# EAGLE design reflow (EAGLE 5.11)
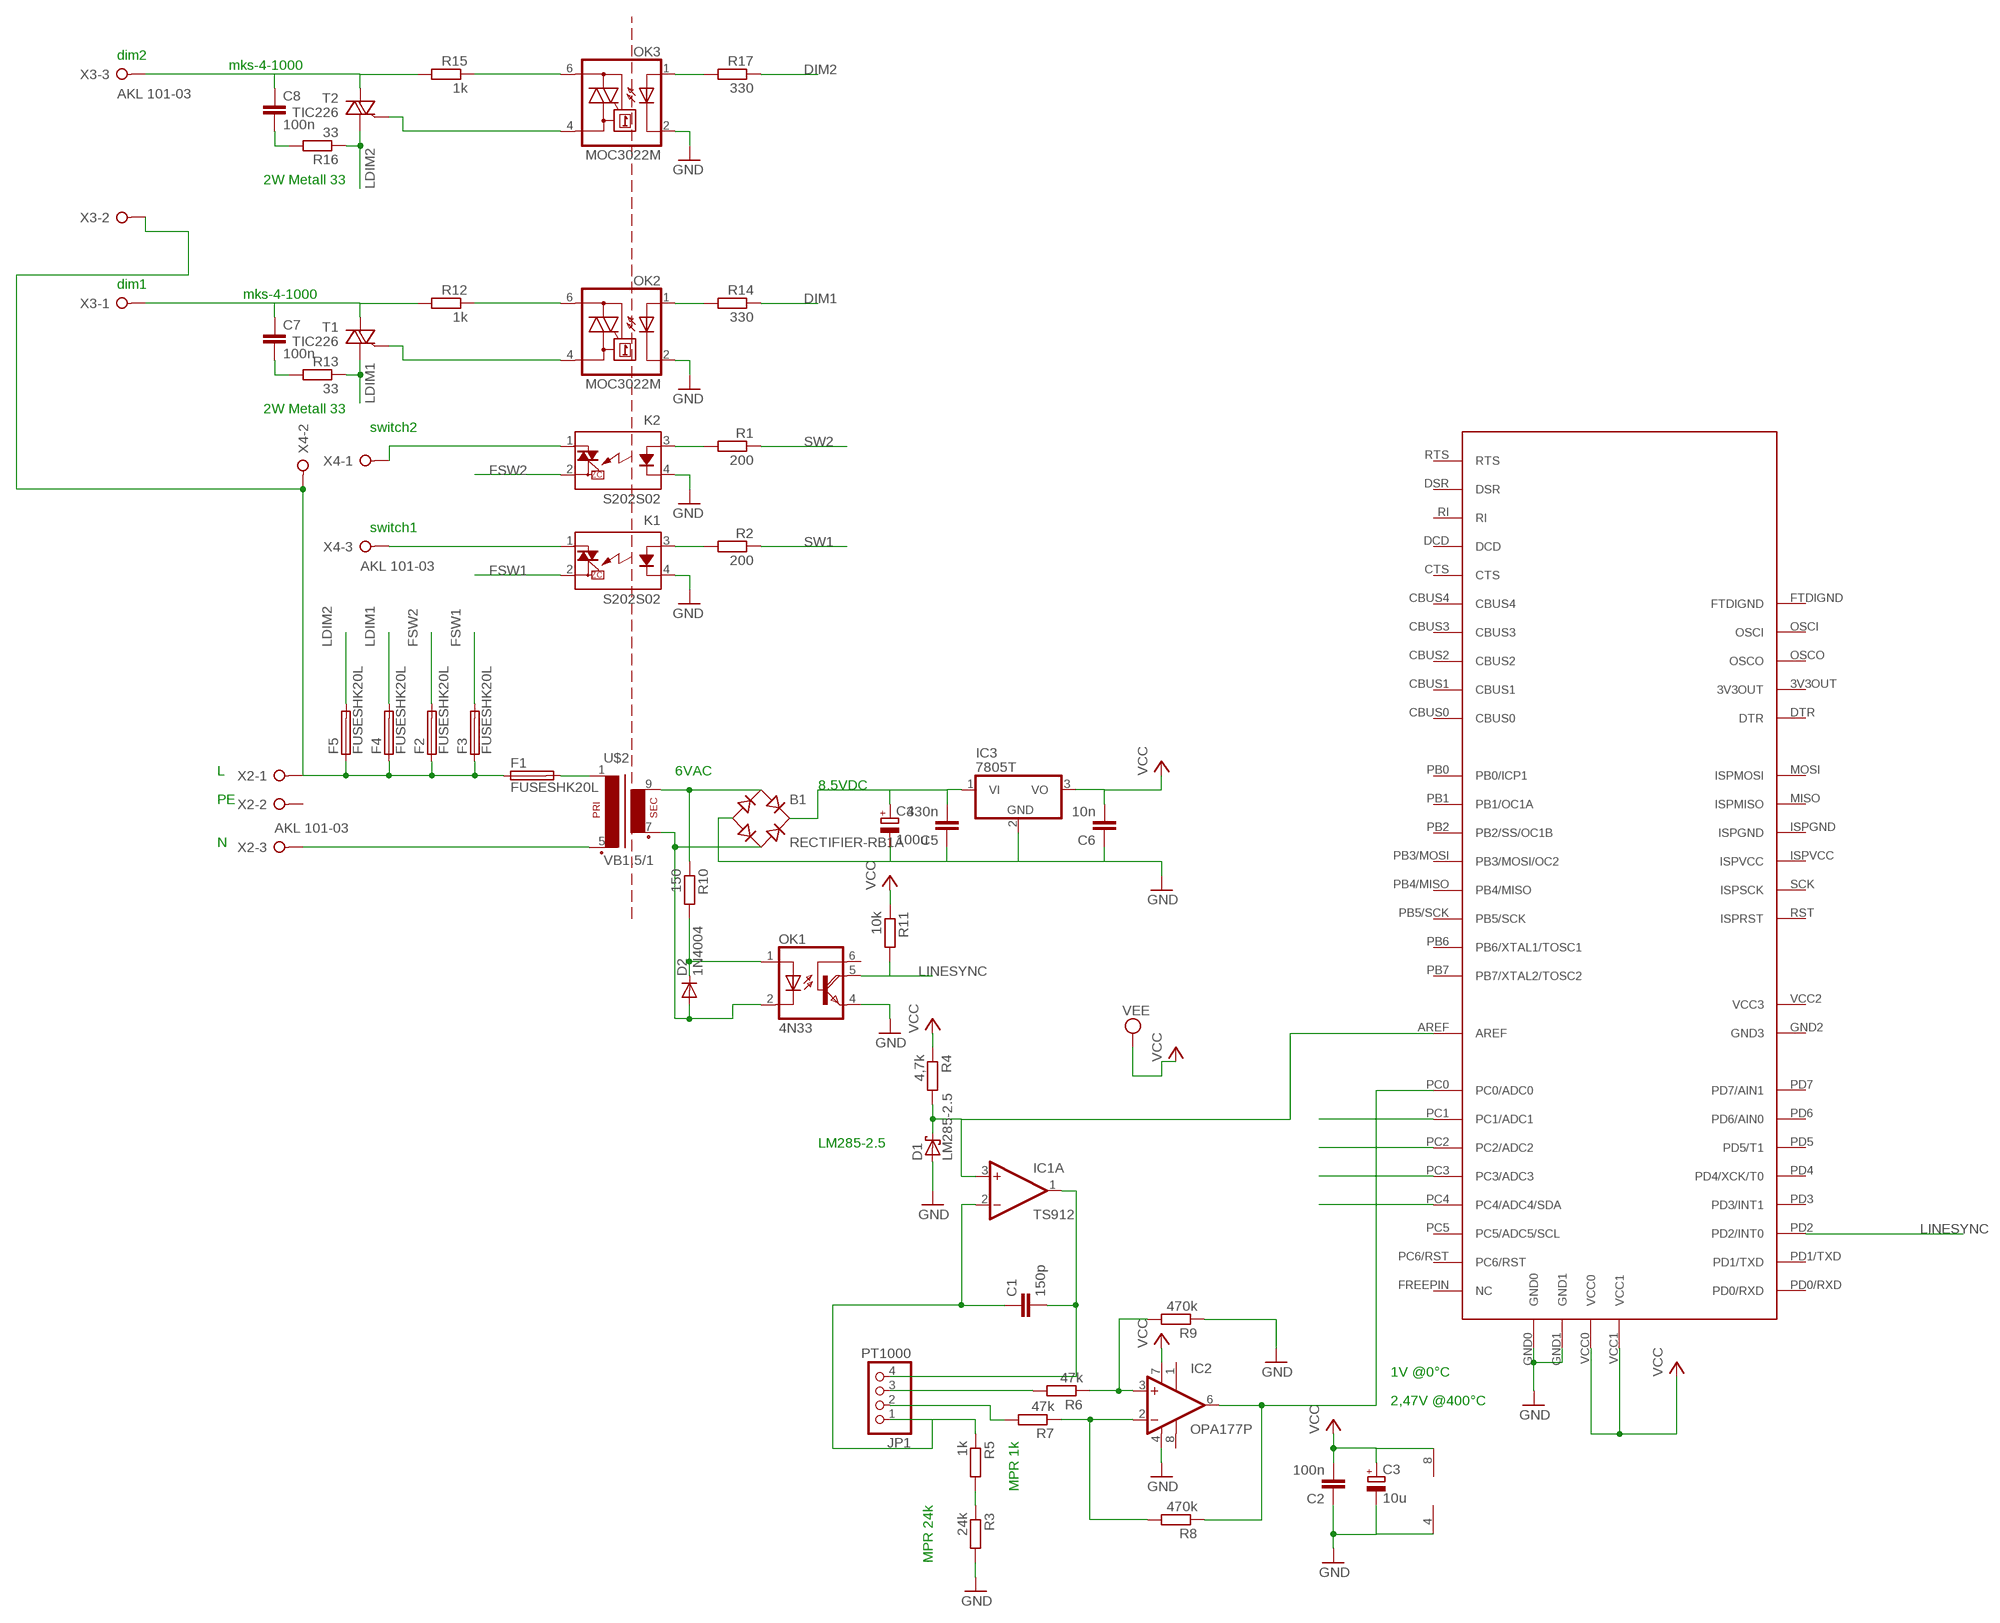
[diagram p0: schematic, sheet 1]

## Parts
B1  RECTIFIER-RB1A  [RB1A]
C1  150p  C-EU050-025X075  [C050-025X075]
C2  100n  C-EU050-025X075  [C050-025X075]
C3  10u  CPOL-EUE2-4  [E2-4]
C4  100u  CPOL-EUE5-13  [E5-13]
C5  330n  C-EU050-025X075  [C050-025X075]
C6  10n  C-EU050-025X075  [C050-025X075]
C7  100n  C-EU225-108X268  [C225-108X268]
C8  100n  C-EU225-108X268  [C225-108X268]
D1  LM285-2.5  SCHOTTKY-DIODETO92H  [TO92H]
D2  1N4004  [DO41-10]
F1  FUSESHK20L  [SHK20L]
F2  FUSESHK20L  [SHK20L]
F3  FUSESHK20L  [SHK20L]
F4  FUSESHK20L  [SHK20L]
F5  FUSESHK20L  [SHK20L]
IC1  TS912  LM358N  [DIL08]
IC2  OPA177P  [DIL08]
IC3  7805T  [TO220H]
JP1  PT1000  PINHD-1X4  [1X04]
K1  S202S02  [S202S02]
K2  S202S02  [S202S02]
OK1  4N33  [DIL06]
OK2  MOC3022M  [DIL06]
OK3  MOC3022M  [DIL06]
R1  200  R-EU_0207/10  [0207/10]
R2  200  R-EU_0207/10  [0207/10]
R3  24k  R-EU_0207/10  [0207/10]
R4  4,7k  R-EU_0207/10  [0207/10]
R5  1k  R-EU_0207/10  [0207/10]
R6  47k  R-EU_0207/10  [0207/10]
R7  47k  R-EU_0207/10  [0207/10]
R8  470k  R-EU_0207/10  [0207/10]
R9  470k  R-EU_0207/10  [0207/10]
R10  150  R-EU_0207/10  [0207/10]
R11  10k  R-EU_0207/10  [0207/10]
R12  1k  R-EU_0207/10  [0207/10]
R13  33  R-EU_0309/12  [0309/12]
R14  330  R-EU_0207/10  [0207/10]
R15  1k  R-EU_0207/10  [0207/10]
R16  33  R-EU_0309/12  [0309/12]
R17  330  R-EU_0207/10  [0207/10]
T1  TIC226  TIC206D  [TO220BV]
T2  TIC226  TIC206D  [TO220BV]
U$1  TORTILLA-ALL  [TORTILLA-ALL]
U$2  VB1.5/1  [VB15]
X2  AKL 101-03  W237-3E  [W237-3E]
X3  AKL 101-03  W237-3E  [W237-3E]
X4  AKL 101-03  W237-3E  [W237-3E]

## Nets
DIM1: R14.1 U$1.PC2(PC2/ADC2)
DIM2: R17.1 U$1.PC1(PC1/ADC1)
FSW1: F3.2A K1.2(DS2)
FSW2: F2.2A K2.2(DS2)
GND: B1.- C2.1 C3.- C4.- C5.1 C6.1 D1.1(A) IC1.4(P:V-) IC2.4(V-) IC3.2(GND) K1.4(K) K2.4(K) OK1.4(E) OK2.2(C) OK3.2(C) R3.2 R9.1 U$1.GND0 U$1.GND1
LDIM1: F4.2A R13.1 T1.T1(A1)
LDIM2: F5.2A R16.1 T2.T1(A1)
LINESYNC: OK1.5(COL) R11.2 U$1.PD2(PD2/INT0)
N$2: C1.1 IC1.2(A:-IN) JP1.1 R5.1
N$3: C1.2 IC1.1(A:OUT) JP1.4
N$4: R3.1 R5.2
N$5: U$2.5(P2) X2.3
N$6: IC2.3(+IN) R6.1 R9.2
N$7: IC2.2(-IN) R7.1 R8.2
N$8: JP1.3 R6.2
N$9: JP1.2 R7.2
N$10: IC2.6(OUT) R8.1 U$1.PC0(PC0/ADC0)
N$11: C8.2 R16.2
N$12: C7.2 R13.2
N$13: K2.1(DS1) X4.1
N$14: K1.3(A) R2.2
N$15: K2.3(A) R1.2
N$16: K1.1(DS1) X4.3
N$17: D2.C OK1.1(A) R10.2
N$18: F1.2A U$2.1
N$19: B1.AC1 R10.1 U$2.9(S4)
N$20: OK2.6(A2) R12.1
N$21: OK2.4(A1) T1.G
N$22: B1.+ C4.+ C5.2 IC3.1(VI)
N$23: F1.1A F2.1A F3.1A F4.1A F5.1A X2.1 X3.2 X4.2
N$24: B1.AC2 D2.A OK1.2(C) U$2.7(S3)
N$25: D1.2(C) IC1.3(A:+IN) R4.2 U$1.AREF
N$26: C7.1 R12.2 T1.T2(A2) X3.1
N$27: OK2.1(A) R14.2
N$29: OK3.6(A2) R15.1
N$30: OK3.4(A1) T2.G
N$31: C8.1 R15.2 T2.T2(A2) X3.3
N$33: OK3.1(A) R17.2
SW1: R2.1 U$1.PC4(PC4/ADC4/SDA)
SW2: R1.1 U$1.PC3(PC3/ADC3)
VCC: C2.2 C3.+ C6.2 IC1.8(P:V+) IC2.7(V+) IC3.3(VO) R4.1 R11.1 U$1.VCC0 U$1.VCC1 ; supply symbol labelled VEE
Unconnected: IC1.5(B:+IN) IC1.6(B:-IN) IC1.7(B:OUT) IC2.1(TRIM1) IC2.8(TRIM2) OK1.6(B) U$1.3V3OUT U$1.CBUS0 U$1.CBUS1 U$1.CBUS2 U$1.CBUS3 U$1.CBUS4 U$1.CTS U$1.DCD U$1.DSR U$1.DTR U$1.FREEPIN(NC) U$1.FTDIGND U$1.GND2(GND3) U$1.ISPGND U$1.ISPVCC U$1.MISO(ISPMISO) U$1.MOSI(ISPMOSI) U$1.OSCI U$1.OSCO U$1.PB0(PB0/ICP1) U$1.PB1(PB1/OC1A) U$1.PB2(PB2/SS/OC1B) U$1.PB3/MOSI(PB3/MOSI/OC2) U$1.PB4/MISO U$1.PB5/SCK U$1.PB6(PB6/XTAL1/TOSC1) U$1.PB7(PB7/XTAL2/TOSC2) U$1.PC5(PC5/ADC5/SCL) U$1.PC6/RST U$1.PD0/RXD U$1.PD1/TXD U$1.PD3(PD3/INT1) U$1.PD4(PD4/XCK/T0) U$1.PD5(PD5/T1) U$1.PD6(PD6/AIN0) U$1.PD7(PD7/AIN1) U$1.RI U$1.RST(ISPRST) U$1.RTS U$1.SCK(ISPSCK) U$1.VCC2(VCC3) X2.2

## Notes on the sheet
- dim2 | mks-4-1000
- 2W Metall 33
- dim1 | mks-4-1000
- 2W Metall 33
- switch2
- switch1
- L | 6VAC
- 8.5VDC
- PE
- N
- LM285-2.5
- 1V @0°C
- 2,47V @400°C
- MPR 1k
- MPR 24k

## Library data of the parts
B1 = rectifier:RECTIFIER-: Rectifier
C1 C2 C5-C8 = rcl:C-EU: CAPACITOR, European symbol
C3 C4 = rcl:CPOL-EU: POLARIZED CAPACITOR, European symbol
D1 = diode:SCHOTTKY-DIODE: Schottky Diode
D2 = diode:1N4004: DIODE general purpose rectifier, 1 A
F1-F5 = fuse:FUSE: Fuse; OC_FARNELL: unknown; OC_NEWARK: unknown
IC1 = linear:LM358: OP AMP also LM158; LM258; LM2904 Source: http://cache.national.com/ds/LM/LM158.pdf
IC2 = burr-brown:OPA177: Precision Operational Amplifier; MPN: OPA177GPG4; OC_FARNELL: 1219410; OC_NEWARK: 05M0933
IC3 = linear:78*: Positive VOLTAGE REGULATOR Source: http://cache.national.com/ds/LM/LM78L05.pdf http://www.fairchildsemi.com/ds/LM/LM7805.pdf
JP1 = pinhead:PINHD-1X4: PIN HEADER
K1 K2 = relay:S*02S02: IT(rms) 8A, Zero Cross type SIP 4pin Triac output SSR Source: http://sharp-world.com/products/device/lineup/data/pdf/datasheet/s102s02_e.pdf; MPN: S202S02F; OC_FARNELL: 1618475; OC_NEWARK: 14N9588
OK1 = optocoupler:4N33: MOTOROLA OPTO COUPLER; MF: VISHAY/TELEFUNKEN; MPN: 4N33; OC_FARNELL: 1469601; OC_NEWARK: 88K1390
OK2 OK3 = optocoupler:MOC30*M: RANDOM-PHASE OPTOISOLATORS TRIAC DRIVER OUTPUT Source: http://www.fairchildsemi.com MOC3020-M.pdf; MF: FAIRCHILD SEMICONDUCTOR; MPN: MOC3022-M; OC_FARNELL: 1021086; OC_NEWARK: 58K1956
R1-R17 = rcl:R-EU_: RESISTOR, European symbol
T1 T2 = triac:TIC206: TRIAC Source: http://www.bourns.com/pdfs/tic206.pdf
U$1 = custom:TORTILLA-ALL
U$2 = custom:VB1.5/1
X2-X4 = con-wago-508:W237-3E: WAGO SREW CLAMP; OC_FARNELL: unknown; OC_NEWARK: unknown

## Board
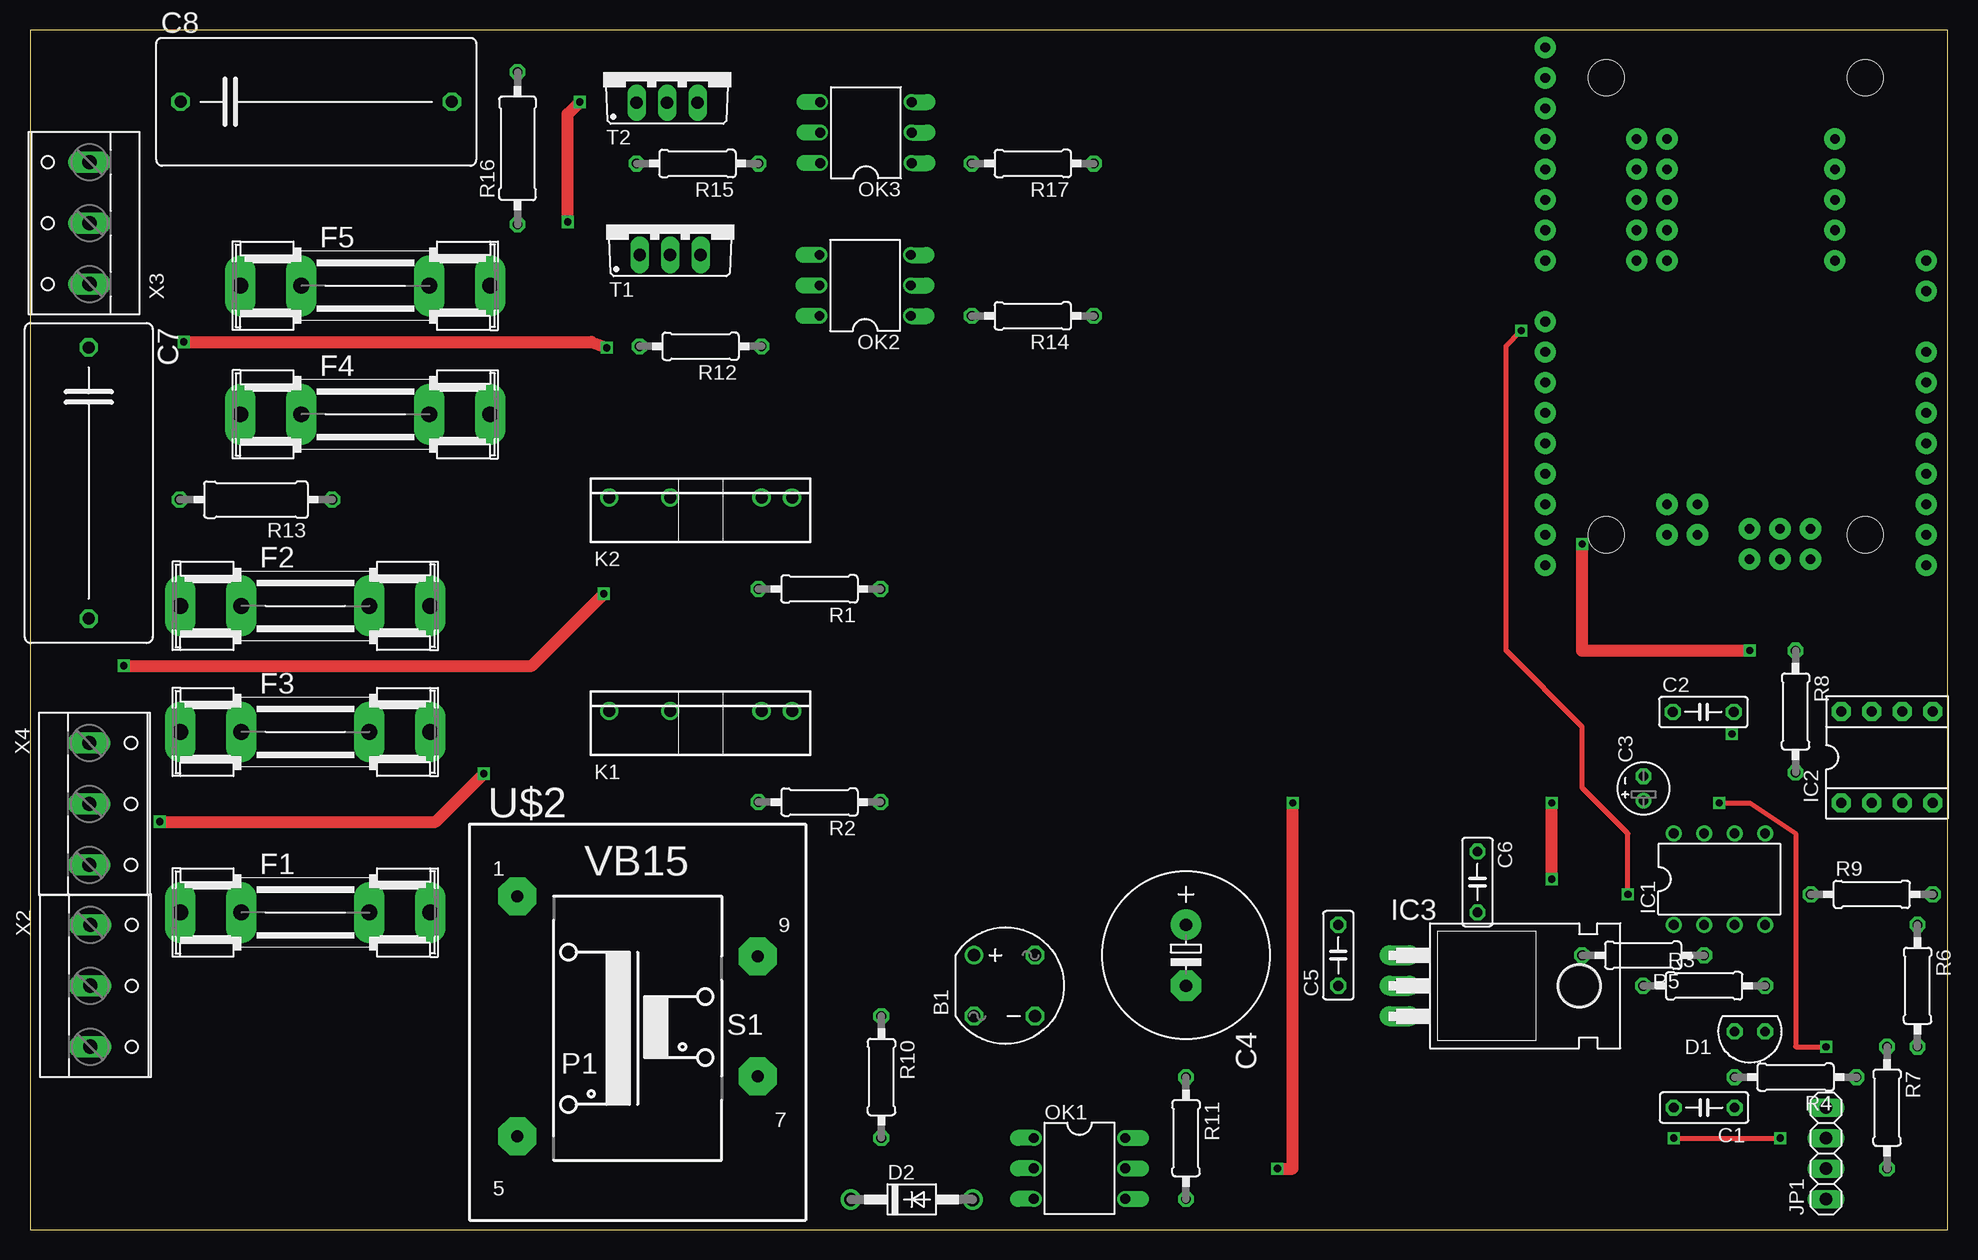
[diagram p1: board, top side]
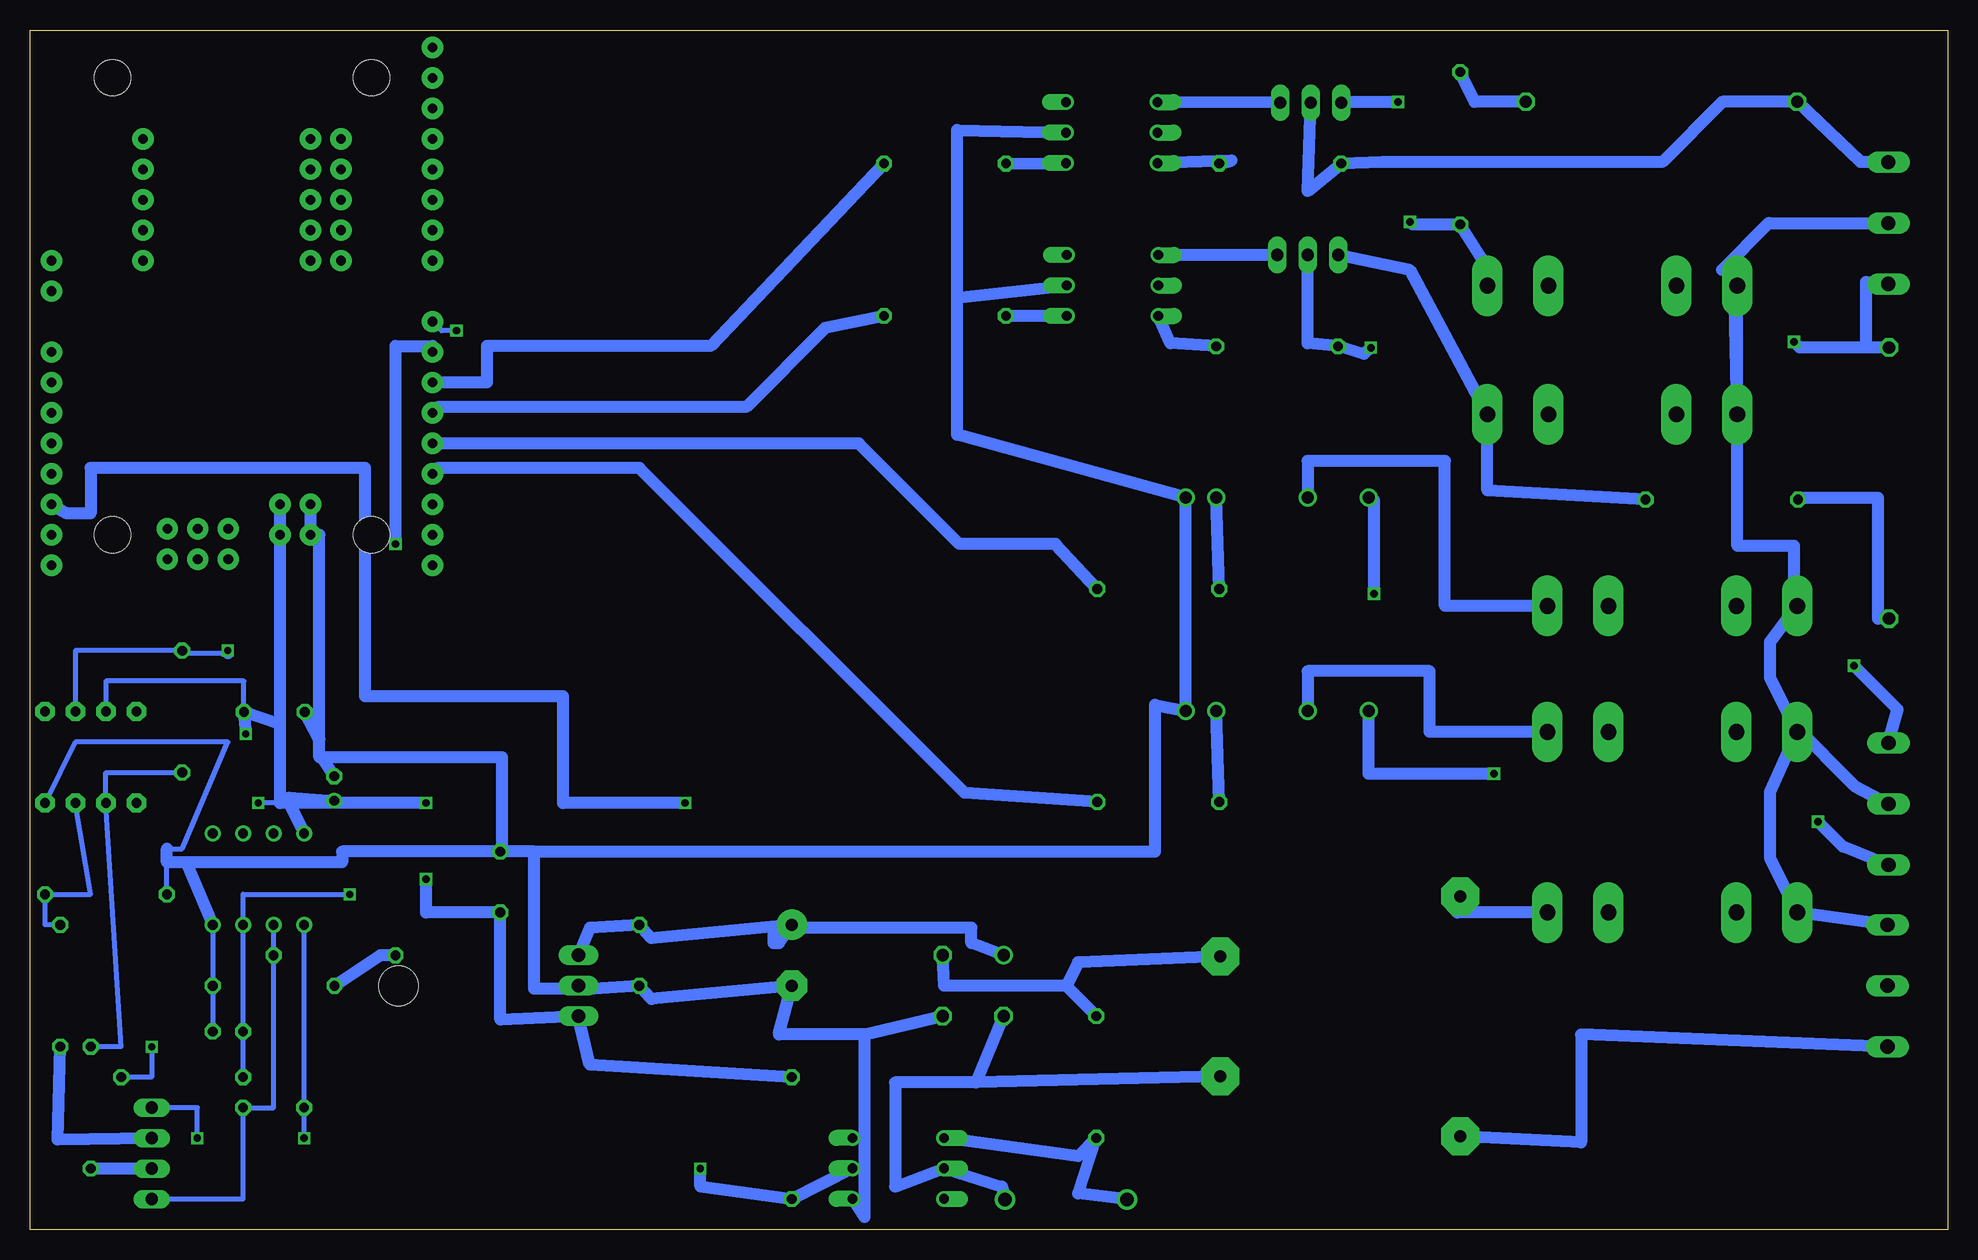
[diagram p2: board, bottom side, seen from below]

Size 159.81 x 100 mm. Coordinates in mm from the lower left corner, seen from the top.
Outline: 0,0 159.81,0 159.81,100 0,100 0,0
Copper layers (1*16): Top 0.035mm / dielectric 1.5mm / Bottom 0.035mm
Design rules "default": minimum track width 10mil, minimum drill 24mil, track to track 8mil, track to pad 8mil, pad to pad 8mil, via to via 8mil, smd to smd 8mil, copper to edge 40mil, drill to drill 8mil, minimum pad ring 10mil, minimum via ring 8mil, stop-mask expansion 4mil, vias tented up to drill 0mil, thermal gap 10mil

### Footprints (pad centres in the part's own frame; a part is rotated, then mirrored left to right if it is on the bottom)
RB1A = drill 1.016 round: + -2.54,2.54 | drill 1.016 octagon: - 2.54,-2.54; AC1 2.54,2.54; AC2 -2.54,-2.54
C050-025X075 = drill 0.813 octagon: 1 -2.54,0; 2 2.54,0
E2-4 = drill 0.813 pad 1.27 round: + -1.016,0 | drill 0.813 pad 1.27 octagon: - 1.016,0
E5-13 = drill 1.016 pad 2.54 round: + -2.54,0 | drill 1.016 pad 2.54 octagon: - 2.54,0
C225-108X268 = drill 1.016 octagon: 1 -11.303,0; 2 11.303,0
TO92H = drill 0.813 octagon: 1 -1.27,0; 2 1.27,0
DO41-10 = drill 1.118 round: A 5.08,0; C -5.08,0
SHK20L = drill 1.321 pad 2.54 long: 1A -10.414,0; 1B -5.334,0; 2A 10.414,0; 2B 5.334,0
DIL08 = drill 0.813 pad 1.27 round: 1 -3.81,-3.81; 2 -1.27,-3.81; 3 1.27,-3.81; 4 3.81,-3.81; 5 3.81,3.81; 6 1.27,3.81; 7 -1.27,3.81; 8 -3.81,3.81
DIL08' = drill 0.813 pad 1.6 octagon: 1 -3.81,-3.81; 2 -1.27,-3.81; 3 1.27,-3.81; 4 3.81,-3.81; 5 3.81,3.81; 6 1.27,3.81; 7 -1.27,3.81; 8 -3.81,3.81
TO220H = drill 1.118 long: 1 -2.54,-10.16; 2 0,-10.16; 3 2.54,-10.16 | hole 3.302: 0,4.826
1X04 = drill 1.016 long: 1 -3.81,0; 2 -1.27,0; 3 1.27,0; 4 3.81,0
S202S02 = drill 1 round: 1 -7.62,0; 2 -2.54,0; 3 5.08,0; 4 7.62,0
DIL06 = drill 0.813 offset: 1 -2.54,-3.81; 2 0,-3.81; 3 2.54,-3.81; 4 2.54,3.81; 5 0,3.81; 6 -2.54,3.81
0207/10 = drill 0.813 octagon: 1 -5.08,0; 2 5.08,0
0309/12 = drill 0.813 octagon: 1 -6.35,0; 2 6.35,0
TO220BV = drill 1.016 long: G 2.54,-2.54; T1 -2.54,-2.54; T2 0,-2.54
TORTILLA-ALL = drill 0.8 pad 1.778 round: 3V3OUT 26.67,26.67; AREF 2.54,21.59; CBUS0 26.67,31.75; CBUS1 26.67,29.21; CBUS2 10.16,26.67; CBUS3 12.7,26.67; CBUS4 12.7,29.21; CTS 10.16,29.21; DCD 12.7,31.75; DSR 10.16,31.75; DTR 12.7,36.83; FREEPIN 2.54,1.27; FTDIGND 10.16,36.83; GND0 12.7,6.35; GND1 12.7,3.81; GND2 34.29,26.67; ISPGND 24.638,4.318; ISPVCC 19.558,4.318; MISO 19.558,1.778; MOSI 22.098,4.318; OSCI 26.67,34.29; OSCO 26.67,36.83; PB0 2.54,44.45; PB1 2.54,41.91; PB2 2.54,39.37; PB3/MOSI 2.54,36.83; PB4/MISO 2.54,34.29; PB5/SCK 2.54,31.75; PB6 2.54,29.21; PB7 2.54,26.67; PC0 2.54,19.05; PC1 2.54,16.51; PC2 2.54,13.97; PC3 2.54,11.43; PC4 2.54,8.89; PC5 2.54,6.35; PC6/RST 2.54,3.81; PD0/RXD 34.29,1.27; PD1/TXD 34.29,3.81; PD2 34.29,6.35; PD3 34.29,8.89; PD4 34.29,11.43; PD5 34.29,13.97; PD6 34.29,16.51; PD7 34.29,19.05; RI 12.7,34.29; RST 24.638,1.778; RTS 10.16,34.29; SCK 22.098,1.778; VCC0 15.24,6.35; VCC1 15.24,3.81; VCC2 34.29,24.13 | hole 3: 7.62,3.81; 29.21,3.81; 7.62,41.91; 29.21,41.91
VB15 = drill 1 pad 3.175 octagon: 1 -10.008,11.008; 5 -10.008,-9.008; 7 10.008,-4.004; 9 10.008,6.004
W237-3E = drill 1.194 long: 1 -5.08,-0.635; 2 0,-0.635; 3 5.08,-0.635

### Placement (x,y rotation side)
B1  81.21,20.33 0 top
C1  139.51,10.16 180 top
C2  139.45,43.15 0 top
C3  134.46,36.77 90 top
C4  96.33,22.86 270 top
C5  109.03,22.86 90 top
C6  120.62,28.97 270 top
C7  4.89,62.23 270 top
C8  23.85,94.02 0 top
D1  143.32,16.51 180 top
D2  73.48,2.5 0 top
F1  22.94,26.43 0 top
F2  22.94,51.99 0 top
F3  22.94,41.48 0 top
F4  27.94,67.96 0 top
F5  27.94,78.68 0 top
IC1  140.78,29.21 0 top
IC2  OPA177P  [DIL08']  154.75,39.37 0 top
IC3  124.27,20.32 270 top
JP1  149.67,6.35 90 top
K1  55.88,43.24 0 top
K2  55.88,61.01 0 top
OK1  87.46,5.09 270 top
OK2  69.6,78.71 90 top
OK3  69.66,91.44 90 top
R1  65.79,53.4 180 top
R2  65.79,35.64 180 top
R3  139.51,20.32 0 top
R4  147.13,12.7 180 top
R5  134.43,22.86 180 top
R6  157.29,20.32 270 top
R7  154.75,10.16 270 top
R8  147.13,43.18 270 top
R9  153.48,27.94 0 top
R10  70.95,12.71 270 top
R11  96.33,7.62 270 top
R12  55.88,73.63 180 top
R13  18.83,60.85 180 top
R14  83.57,76.17 180 top
R15  55.63,88.87 180 top
R16  40.63,90.14 90 top
R17  83.57,88.87 180 top
T1  53.34,83.79 0 top
T2  53.09,96.49 0 top
U$1  123.73,54.1 0 top
U$2  50.63,16.78 0 top
X2  5.65,20.32 270 top
X3  4.32,83.9 90 top
X4  5.57,35.48 270 top

### Tracks (layer width: path | path; a pad name or v marks a point on that pad's centre or on a via)
DIM1
  Bottom 1: R14.1 93.57,75.15 100.14,68.58 125.76,68.58 U$1.PC2
DIM2
  Bottom 1: U$1.PC1 121.73,70.61 121.73,73.66 103.09,73.66 R17.1
FSW1
  Bottom 1: F3.2A 43.18,41.48 43.18,46.56 53.34,46.56 K1.2
FSW2
  Bottom 1: F2.2A 41.91,51.99 41.91,64.07 53.34,64.07 K2.2
GND
  Bottom 0.254: IC3.2 112.84,20.32 112.84,20.08 | C6.1 120.46,31.75
  Bottom 0.406: IC1.4 R3.2 D1.1 | 148.4,31.75 147.13,31.75 143.32,40.64 156.02,40.64 IC2.4 | R9.1 148.4,30.62
  Bottom 1: 90.25,16.27 B1.- | 90.25,16.27 97.41,16.27 C4.- 108.03,19.21 C5.1 112.84,20.08 117.81,20.08 117.81,31.51 | OK1.4 90.25,1.03 90.25,16.27 | 82.55,77.69 OK2.2 | 82.55,77.69 82.55,91.66 OK3.2 | 82.55,77.69 82.55,66.26 K2.4 K1.4 66.04,43.75 66.04,31.51 117.81,31.51 | 117.81,31.51 C6.1 133.81,31.51 133.81,30.62 146.81,30.62 | 146.81,30.62 IC1.4 | U$1.GND0 U$1.GND1 135.7,57.91 135.7,40.86 | 135.48,39.37 120.46,39.37 120.46,31.75 | 146.81,30.62 148.4,30.62 148.4,31.75 | 135.7,40.86 C2.1 | 135.7,40.86 135.7,39.37 135.48,39.37 | 135.48,39.37 C3.-
LDIM1
  Bottom 1: T1.T1 44.8,79.96 F4.2A 38.35,61.61 R13.1
LDIM2  (via drill 0.6)
  Top 1: v44.81,84 44.81,93 v45.81,94
  Bottom 1: F5.2A 38.35,80.24 R16.1 44.6,83.79 v44.81,84 | v45.81,94 50.6,94 T2.T1
LINESYNC  (via drill 0.6)
  Top 1: v103.95,5.08 105.22,5.08 v105.22,35.56
  Bottom 1: OK1.5 R11.2 103.95,3.57 v103.95,5.08 | v105.22,35.56 115.38,35.56 115.38,44.45 131.89,44.45 131.89,63.5 154.75,63.5 154.75,59.69 156.75,59.69 U$1.PD2
N$2
  Bottom 0.406: IC1.2 R5.1 139.51,10.16 C1.1 142.05,2.54 JP1.1
N$3  (via drill 0.6)
  Top 0.406: v136.97,7.62 v145.86,7.62
  Bottom 0.406: IC1.1 C1.2 v136.97,7.62 | JP1.4 145.86,10.16 v145.86,7.62
N$4
  Bottom 1: R5.2 130.62,22.86 R3.1
N$5
  Bottom 1: U$2.5 30.56,7.26 30.56,16.27 X2.3
N$6
  Bottom 0.406: R6.1 158.56,25.4 R9.2 154.75,27.94 IC2.3
N$7
  Bottom 0.406: R7.1 152.21,15.24 IC2.2 153.48,38.1 R8.2
N$8
  Bottom 1: JP1.3 157.51,7.5 R6.2
N$9
  Bottom 1: JP1.2 153.48,5.08 R7.2
N$10  (via drill 0.6)
  Top 1: v143.32,48.26 129.35,48.26 v129.35,57.15
  Bottom 0.406: IC2.6 156.02,48.26 R8.1 147.13,48.04 143.32,48.04
  Bottom 1: v143.32,48.26 143.32,48.04 | v129.35,57.15 129.35,73.66 126.27,73.66 U$1.PC0
N$11
  Bottom 1: C8.2 39.43,94.02 R16.2
N$12
  Bottom 1: C7.2 5.81,50.93 5.81,61 11.97,61 R13.2
N$13  (via drill 0.6)
  Top 1: v7.81,47 41.81,47 v47.81,53
  Bottom 1: X4.1 4.17,43.37 v7.81,47 | v47.81,53 47.81,60.81 K2.1
N$14
  Bottom 1: R2.2 K1.3
N$15
  Bottom 1: R1.2 K2.3
N$16  (via drill 0.6)
  Top 1: v10.81,34 33.81,34 v37.81,38
  Bottom 1: X4.3 8.73,31.92 v10.81,34 | v37.81,38 48.26,38 K1.1
N$17
  Bottom 1: OK1.1 72.47,6.11 R10.2 72.47,3.01 D2.C
N$18
  Bottom 1: F1.2A 40.87,26.43 U$2.1
N$19
  Bottom 1: U$2.9 72.47,22.27 73.47,20.32 | 73.47,20.32 R10.1 | B1.AC1 83.63,20.32 73.47,20.32
N$20
  Bottom 1: R12.1 64.77,73.88 OK2.6
N$21
  Bottom 1: T1.G OK2.4
N$22
  Bottom 1: B1.+ 81.36,23.89 81.36,25.16 97.87,25.16 97.87,23.89 97.41,23.89 C4.+ 108.03,24.29 C5.2 113.16,25.16 IC3.1
N$23
  Bottom 1: X2.1 F1.1A 14.81,31 14.81,36.48 F3.1A 12.79,42.01 | F4.1A 17.78,78.96 | F4.1A F5.1A 17.73,80 18.81,80 14.91,83.9 X3.2 | 12.79,42.01 14.81,46 14.81,48.99 F2.1A 12.81,51.99 12.81,57 17.53,57 F4.1A | X4.2 7.78,37 12.79,42.01
N$24
  Bottom 1: D2.A 78.82,3.57 OK1.2 87.71,3.57 87.71,12.27 80.96,12.27 | U$2.7 80.96,12.27 | 80.96,12.27 B1.AC2
N$25  (via drill 0.6)
  Top 0.406: v133.16,27.94 133.16,33.02 129.35,36.83 129.35,41.91 123,48.26 123,73.66 v124.27,74.93
  Bottom 0.406: R4.2 D1.2 IC1.3 142.05,27.94 v133.16,27.94 | v124.27,74.93 125.51,74.93 U$1.AREF
N$26  (via drill 0.6)
  Top 1: v12.81,74 46.81,74 v48.06,73.51
  Bottom 1: T1.T2 53.34,73.88 R12.2 48.65,73 v48.06,73.51 | C7.1 6.81,73.53 | 6.81,73.53 6.81,79 5.71,79 X3.1 | 6.81,73.53 12.34,73.53 v12.81,74
N$27
  Bottom 1: OK2.1 R14.2
N$29
  Bottom 1: OK3.6 59.69,89.12 R15.1
N$30
  Bottom 1: T2.G OK3.4
N$31
  Bottom 1: T2.T2 53.34,86.58 R15.2 47.11,89 23.81,89 18.79,94.02 C8.1 7.26,88.98 X3.3
N$33
  Bottom 1: R17.2 OK3.1
SW1
  Bottom 1: R2.1 81.93,36.4 109.03,63.5 125.76,63.5 U$1.PC4
SW2
  Bottom 1: U$1.PC3 90.74,65.53 82.36,57.15 74.36,57.15 R1.1
VCC  (via drill 0.6)
  Top 0.406: v149.67,15.24 147.13,15.24 147.13,33.02 143.32,35.56 v140.78,35.56
  Top 1: v126.81,29.21 v126.81,35.56
  Bottom 0.406: R4.1 149.67,12.7 v149.67,15.24 | 138.97,35.56 v140.78,35.56 | IC2.7 153.48,45.72 141.99,45.72 C2.2
  Bottom 1: R11.1 113.16,13.73 IC3.3 120.62,17.48 C6.2 126.81,26.43 v126.81,29.21 | v126.81,35.56 138.24,35.56 | 138.24,35.56 138.97,35.56 138.97,42.1 | 138.97,42.1 U$1.VCC1 U$1.VCC0 | 138.24,35.56 IC1.8 | v141.83,41.32 C2.2 138.97,42.1 | C3.+ 138.24,36 138.24,35.56